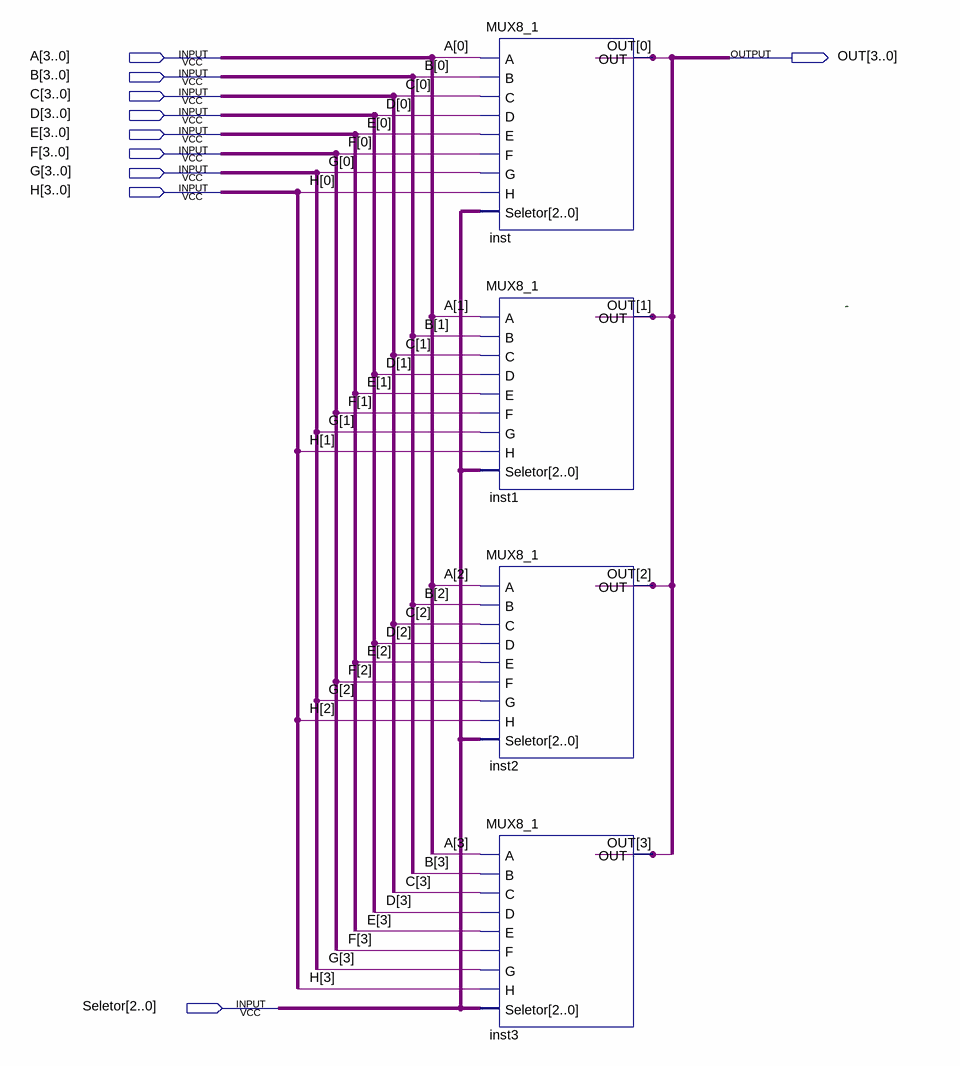
[diagram p0: schematic sheet]
// Quartus schematic MUX8_1_4bits.bdf as structural Verilog: 4 symbols, 10 pins
module MUX8_1_4bits (
  input  [3:0] A,
  input  [3:0] B,
  input  [3:0] C,
  input  [3:0] D,
  input  [3:0] E,
  input  [3:0] F,
  input  [3:0] G,
  input  [3:0] H,
  input  [2:0] Seletor,
  output [3:0] OUT
);

  MUX8_1 inst (
    .A(A[0]), .B(B[0]), .C(C[0]), .D(D[0]), .E(E[0]), .F(F[0]), .G(G[0]), .H(H[0]), .Seletor(Seletor),
    .OUT(OUT[0]));
  MUX8_1 inst1 (
    .A(A[1]), .B(B[1]), .C(C[1]), .D(D[1]), .E(E[1]), .F(F[1]), .G(G[1]), .H(H[1]), .Seletor(Seletor),
    .OUT(OUT[1]));
  MUX8_1 inst2 (
    .A(A[2]), .B(B[2]), .C(C[2]), .D(D[2]), .E(E[2]), .F(F[2]), .G(G[2]), .H(H[2]), .Seletor(Seletor),
    .OUT(OUT[2]));
  MUX8_1 inst3 (
    .A(A[3]), .B(B[3]), .C(C[3]), .D(D[3]), .E(E[3]), .F(F[3]), .G(G[3]), .H(H[3]), .Seletor(Seletor),
    .OUT(OUT[3]));

  // Notes on the sheet:
  //   -
endmodule
